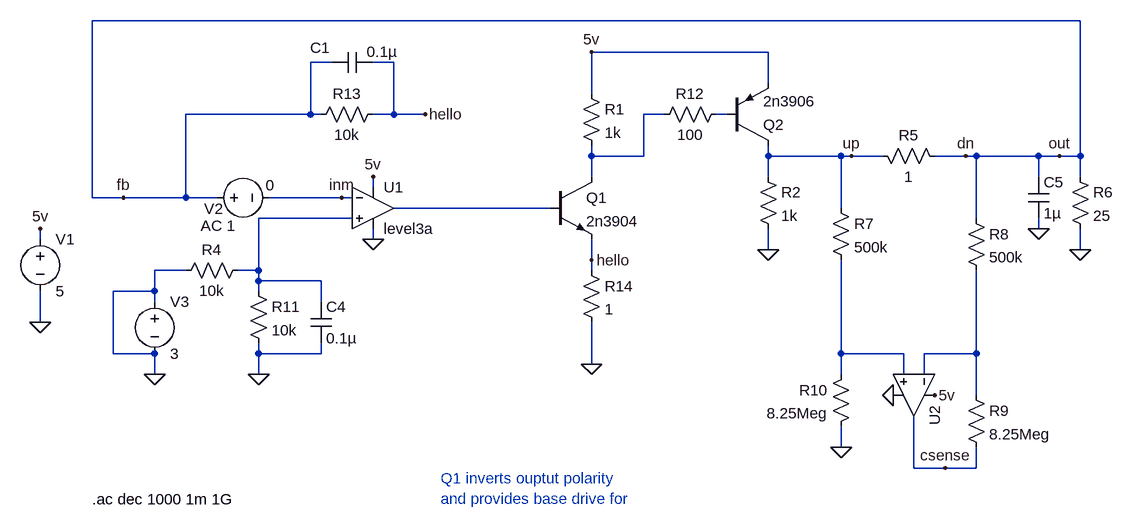
[diagram p0: schematic diff_amp_sim_ac.asc]
diff_amp_sim_ac.asc, the LTspice schematic file:
Version 4
SHEET 1 1300 1124
WIRE 1120 -96 -400 -96
WIRE 640 -48 368 -48
WIRE -32 -32 -64 -32
WIRE 64 -32 32 -32
WIRE 640 0 640 -48
WIRE 368 16 368 -48
WIRE -64 48 -64 -32
WIRE -64 48 -256 48
WIRE -48 48 -64 48
WIRE 64 48 64 -32
WIRE 64 48 32 48
WIRE 112 48 64 48
WIRE 480 48 448 48
WIRE 576 48 560 48
WIRE 368 112 368 96
WIRE 448 112 448 48
WIRE 448 112 368 112
WIRE 640 112 640 96
WIRE 752 112 640 112
WIRE 768 112 752 112
WIRE 816 112 768 112
WIRE 944 112 896 112
WIRE 960 112 944 112
WIRE 1056 112 960 112
WIRE 1088 112 1056 112
WIRE 1120 112 1120 -96
WIRE 1120 112 1088 112
WIRE 368 144 368 112
WIRE 640 144 640 112
WIRE 1056 144 1056 112
WIRE 1120 144 1120 112
WIRE 32 160 32 144
WIRE -400 176 -400 -96
WIRE -352 176 -400 176
WIRE -256 176 -256 48
WIRE -256 176 -352 176
WIRE -208 176 -256 176
WIRE -16 176 -128 176
WIRE 0 176 -16 176
WIRE 304 192 64 192
WIRE 752 192 752 112
WIRE 0 208 -144 208
WIRE 960 208 960 112
WIRE 1056 224 1056 208
WIRE -480 240 -480 224
WIRE 32 240 32 224
WIRE 640 256 640 224
WIRE 1120 256 1120 224
WIRE 368 272 368 240
WIRE -256 288 -304 288
WIRE -144 288 -144 208
WIRE -144 288 -176 288
WIRE 368 288 368 272
WIRE -144 304 -144 288
WIRE -48 304 -144 304
WIRE -304 320 -304 288
WIRE -304 320 -368 320
WIRE -144 320 -144 304
WIRE -304 336 -304 320
WIRE -48 336 -48 304
WIRE -480 368 -480 320
WIRE -368 416 -368 320
WIRE -304 416 -368 416
WIRE -144 416 -144 400
WIRE -48 416 -48 400
WIRE -48 416 -144 416
WIRE 752 416 752 272
WIRE 848 416 752 416
WIRE 960 416 960 288
WIRE 960 416 880 416
WIRE 368 432 368 368
WIRE -304 448 -304 416
WIRE -144 448 -144 416
WIRE 752 448 752 416
WIRE 848 448 848 416
WIRE 880 448 880 416
WIRE 960 480 960 416
WIRE 752 560 752 528
WIRE 864 592 864 512
WIRE 912 592 864 592
WIRE 960 592 960 560
WIRE 960 592 912 592
FLAG -480 368 0
FLAG -304 448 0
FLAG 32 144 5v
FLAG 32 240 0
FLAG 368 -48 5v
FLAG -480 224 5v
FLAG 368 432 0
FLAG 640 256 0
FLAG 1120 256 0
FLAG 896 480 5v
FLAG 832 480 0
FLAG 752 560 0
FLAG 1088 112 out
FLAG 912 592 csense
FLAG 768 112 up
FLAG 944 112 dn
FLAG -352 176 fb
FLAG -16 176 inm
FLAG 1056 224 0
FLAG -144 448 0
FLAG 368 272 hello
FLAG 112 48 hello
SYMBOL voltage -480 224 R0
SYMATTR InstName V1
SYMATTR Value 5
SYMBOL voltage -224 176 R270
WINDOW 3 19 91 VRight 2
WINDOW 123 -43 -9 VRight 2
WINDOW 39 0 0 Left 0
WINDOW 0 -17 -4 VRight 2
SYMATTR Value 0
SYMATTR Value2 AC 1
SYMATTR InstName V2
SYMBOL npn 304 144 R0
SYMATTR InstName Q1
SYMATTR Value 2n3904
SYMBOL res 352 0 R0
SYMATTR InstName R1
SYMATTR Value 1k
SYMBOL pnp 576 96 M180
SYMATTR InstName Q2
SYMATTR Value 2n3906
SYMBOL res 624 128 R0
SYMATTR InstName R2
SYMATTR Value 1k
SYMBOL res 800 96 M90
WINDOW 0 0 56 VBottom 2
WINDOW 3 32 56 VTop 2
SYMATTR InstName R5
SYMATTR Value 1
SYMBOL res 1104 128 R0
SYMATTR InstName R6
SYMATTR Value 25
SYMBOL res 736 176 R0
SYMATTR InstName R7
SYMATTR Value 500k
SYMBOL res 944 192 R0
SYMATTR InstName R8
SYMATTR Value 500k
SYMBOL OpAmps\\UniversalOpAmp2 864 480 R90
SYMATTR InstName U2
SYMBOL res 944 464 R0
SYMATTR InstName R9
SYMATTR Value 8.25Meg
SYMBOL res 768 432 M0
SYMATTR InstName R10
SYMATTR Value 8.25Meg
SYMBOL res 576 32 R90
WINDOW 0 0 56 VBottom 2
WINDOW 3 32 56 VTop 2
SYMATTR InstName R12
SYMATTR Value 100
SYMBOL voltage -304 320 R0
WINDOW 123 0 0 Left 0
WINDOW 39 0 0 Left 0
SYMATTR InstName V3
SYMATTR Value 3
SYMBOL OpAmps\\UniversalOpAmp3 32 192 R0
SYMATTR InstName U1
SYMBOL cap 1040 144 R0
SYMATTR InstName C5
SYMATTR Value 1µ
SYMBOL res -160 272 R90
WINDOW 0 0 56 VBottom 2
WINDOW 3 32 56 VTop 2
SYMATTR InstName R4
SYMATTR Value 10k
SYMBOL res -160 304 R0
SYMATTR InstName R11
SYMATTR Value 10k
SYMBOL res 48 32 R90
WINDOW 0 0 56 VBottom 2
WINDOW 3 32 56 VTop 2
SYMATTR InstName R13
SYMATTR Value 10k
SYMBOL res 352 272 R0
SYMATTR InstName R14
SYMATTR Value 1
SYMBOL cap 32 -48 R90
WINDOW 0 9 81 VBottom 2
WINDOW 3 -16 -14 VTop 2
SYMATTR InstName C1
SYMATTR Value 0.1µ
SYMBOL cap -64 336 R0
SYMATTR InstName C4
SYMATTR Value 0.1µ
TEXT 136 608 Left 2 ;Q1 inverts ouptut polarity\nand provides base drive for
TEXT -400 640 Left 2 !.ac dec 1000 1m 1G

The netlist it stands for:
* diff_amp_sim_ac.asc
V1 5v 0 5
V2 fb inm 0 AC 1
Q1 N001 N003 hello 0 2n3904
R1 5v N001 1k
Q2 up N002 5v 0 2n3906
R2 up 0 1k
R5 up fb 1
R6 fb 0 25
R7 up N005 500k
R8 fb N006 500k
XU2 N005 N006 5v 0 csense level2 Avol=1Meg GBW=10Meg Slew=10Meg Ilimit=25m Rail=0 Vos=0 En=0 Enk=0 In=0 Ink=0 Rin=500Meg  ; pins In+ In- V+ V- OUT
R9 N006 csense 8.25Meg
R10 N005 0 8.25Meg
R12 N002 N001 100
V3 0 0 3
XU1 N004 inm 5v 0 N003 level3a  ; pins In+ In- V+ V- OUT
C5 fb 0 1µ
R4 N004 0 10k
R11 N004 0 10k
R13 hello fb 10k
R14 hello 0 1
C1 hello fb 0.1µ
C4 N004 0 0.1µ
.model NPN NPN
.model PNP PNP
.lib standard.bjt
* Q1 inverts ouptut polarity
* and provides base drive for
.ac dec 1000 1m 1G
.lib UniversalOpAmp2.lib
.backanno
.end